# Altium schematic sheet KeyBoard_LED.SchDoc
size A1
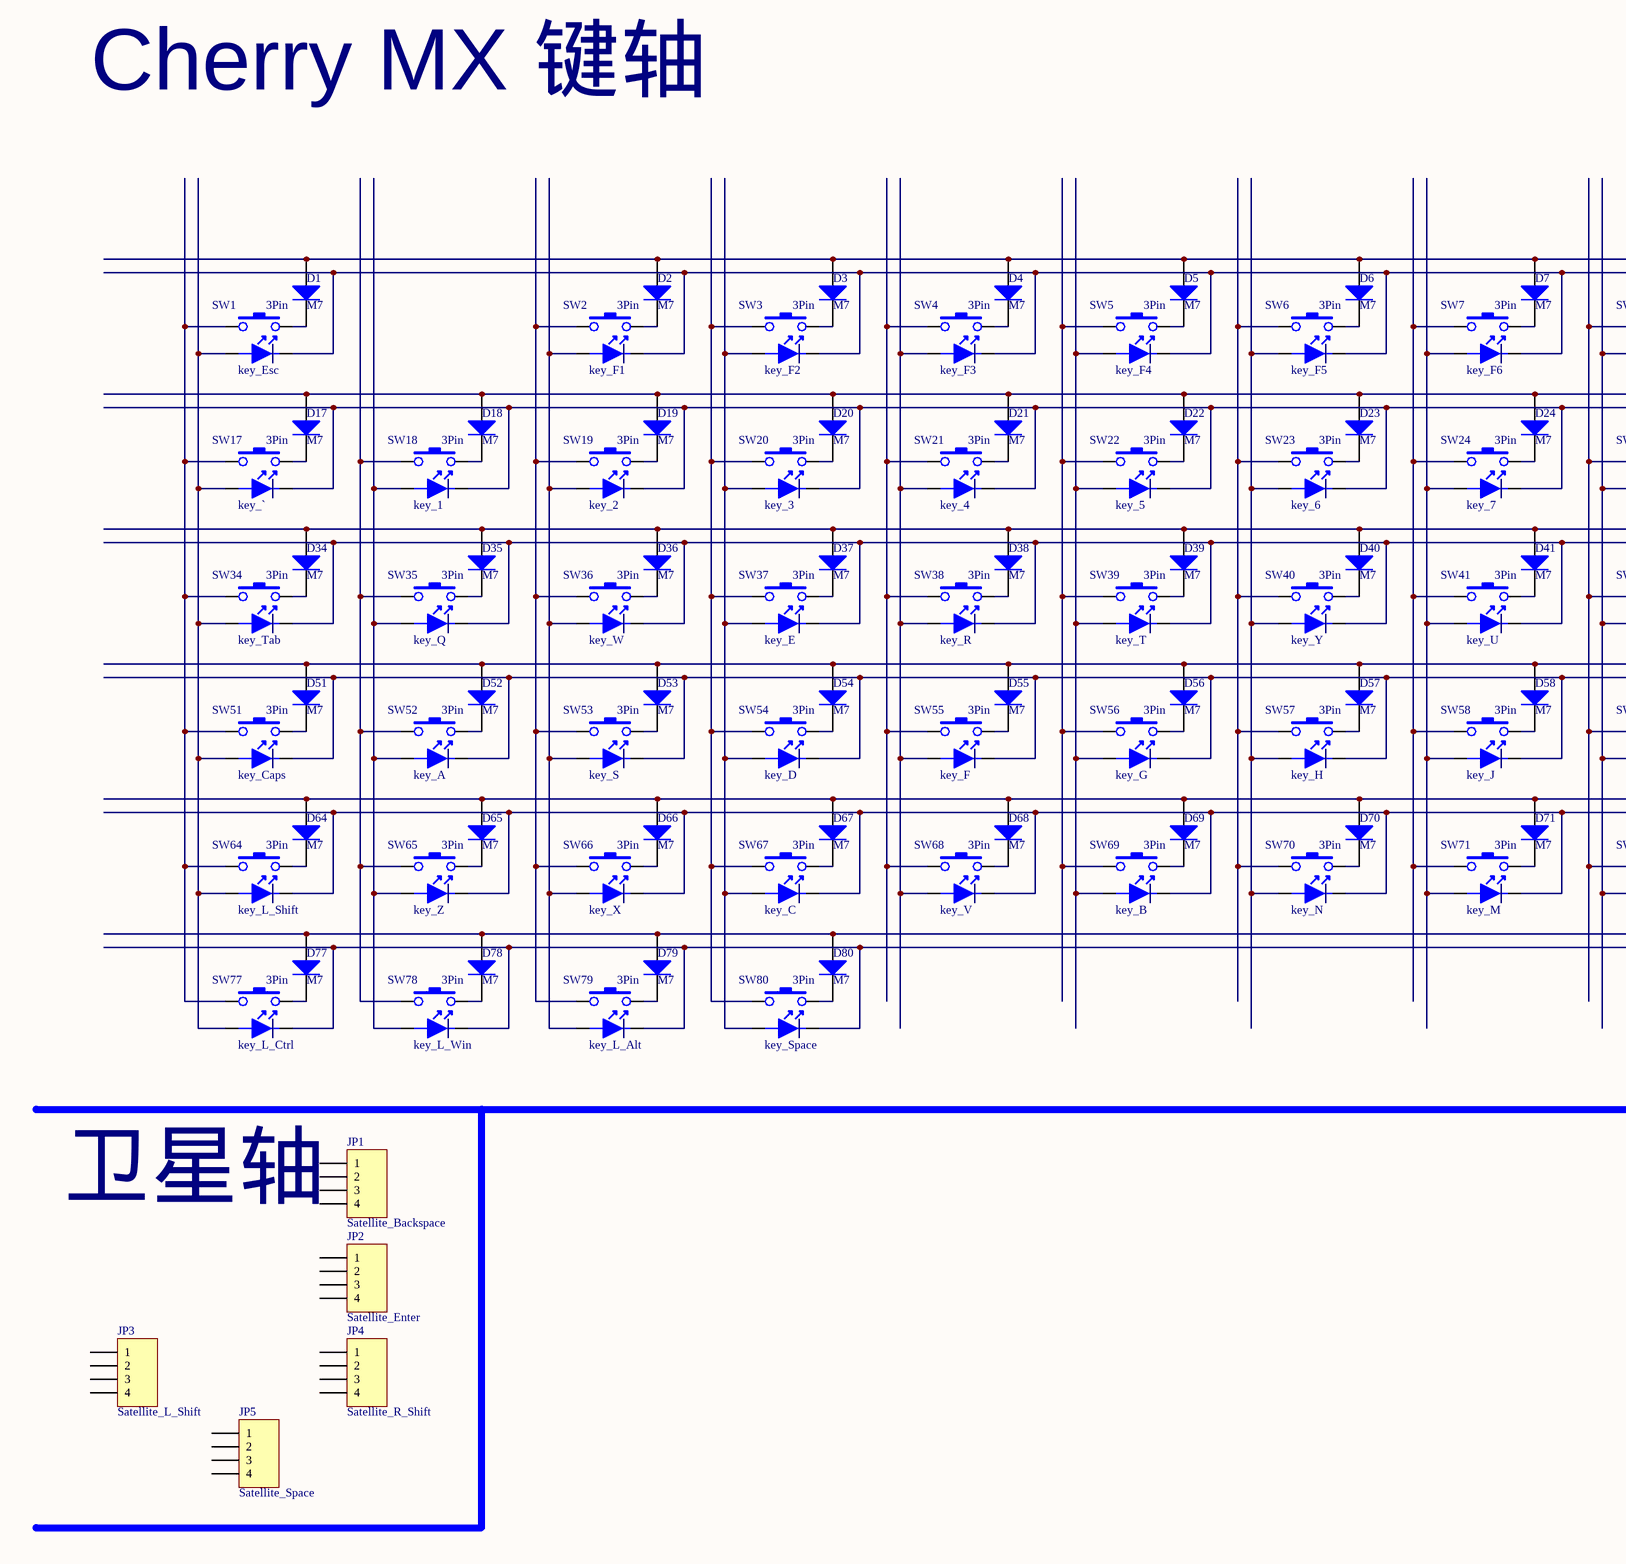
[diagram p0: KeyBoard_LED.SchDoc, left]
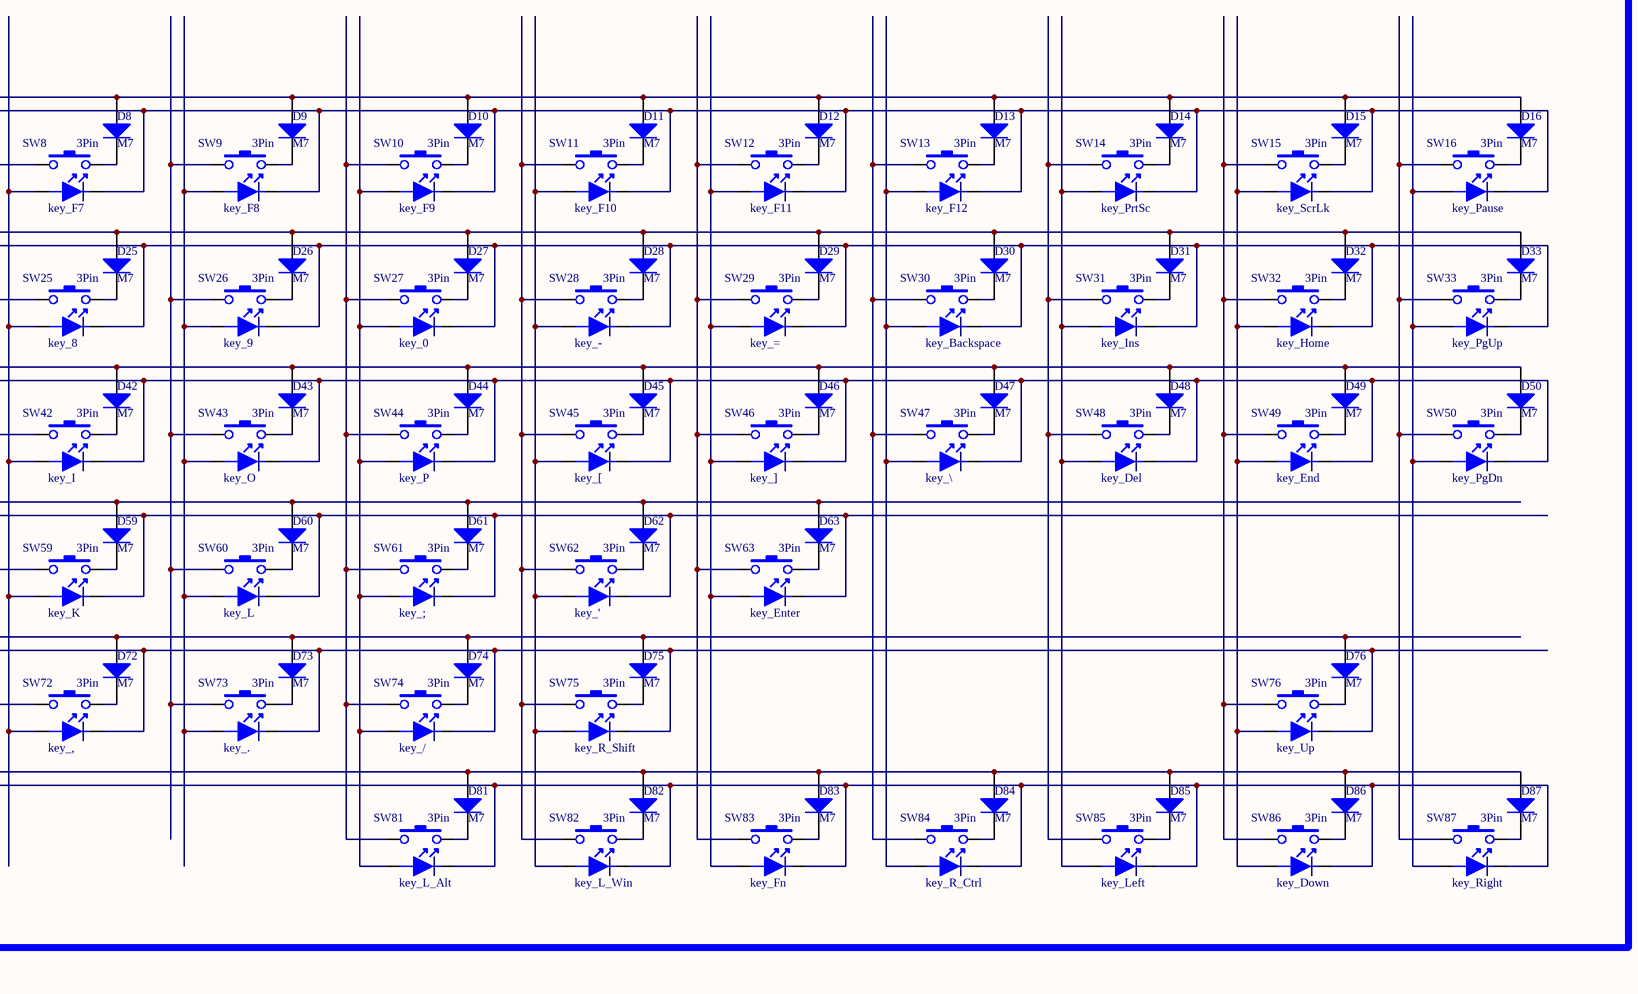
[diagram p1: KeyBoard_LED.SchDoc, right]

## Parts
D1  M7  [SMA(DO-214AC)_S1]
D2  M7  [SMA(DO-214AC)_S1]
D3  M7  [SMA(DO-214AC)_S1]
D4  M7  [SMA(DO-214AC)_S1]
D5  M7  [SMA(DO-214AC)_S1]
D6  M7  [SMA(DO-214AC)_S1]
D7  M7  [SMA(DO-214AC)_S1]
D8  M7  [SMA(DO-214AC)_S1]
D9  M7  [SMA(DO-214AC)_S1]
D10  M7  [SMA(DO-214AC)_S1]
D11  M7  [SMA(DO-214AC)_S1]
D12  M7  [SMA(DO-214AC)_S1]
D13  M7  [SMA(DO-214AC)_S1]
D14  M7  [SMA(DO-214AC)_S1]
D15  M7  [SMA(DO-214AC)_S1]
D16  M7  [SMA(DO-214AC)_S1]
D17  M7  [SMA(DO-214AC)_S1]
D18  M7  [SMA(DO-214AC)_S1]
D19  M7  [SMA(DO-214AC)_S1]
D20  M7  [SMA(DO-214AC)_S1]
D21  M7  [SMA(DO-214AC)_S1]
D22  M7  [SMA(DO-214AC)_S1]
D23  M7  [SMA(DO-214AC)_S1]
D24  M7  [SMA(DO-214AC)_S1]
D25  M7  [SMA(DO-214AC)_S1]
D26  M7  [SMA(DO-214AC)_S1]
D27  M7  [SMA(DO-214AC)_S1]
D28  M7  [SMA(DO-214AC)_S1]
D29  M7  [SMA(DO-214AC)_S1]
D30  M7  [SMA(DO-214AC)_S1]
D31  M7  [SMA(DO-214AC)_S1]
D32  M7  [SMA(DO-214AC)_S1]
D33  M7  [SMA(DO-214AC)_S1]
D34  M7  [SMA(DO-214AC)_S1]
D35  M7  [SMA(DO-214AC)_S1]
D36  M7  [SMA(DO-214AC)_S1]
D37  M7  [SMA(DO-214AC)_S1]
D38  M7  [SMA(DO-214AC)_S1]
D39  M7  [SMA(DO-214AC)_S1]
D40  M7  [SMA(DO-214AC)_S1]
D41  M7  [SMA(DO-214AC)_S1]
D42  M7  [SMA(DO-214AC)_S1]
D43  M7  [SMA(DO-214AC)_S1]
D44  M7  [SMA(DO-214AC)_S1]
D45  M7  [SMA(DO-214AC)_S1]
D46  M7  [SMA(DO-214AC)_S1]
D47  M7  [SMA(DO-214AC)_S1]
D48  M7  [SMA(DO-214AC)_S1]
D49  M7  [SMA(DO-214AC)_S1]
D50  M7  [SMA(DO-214AC)_S1]
D51  M7  [SMA(DO-214AC)_S1]
D52  M7  [SMA(DO-214AC)_S1]
D53  M7  [SMA(DO-214AC)_S1]
D54  M7  [SMA(DO-214AC)_S1]
D55  M7  [SMA(DO-214AC)_S1]
D56  M7  [SMA(DO-214AC)_S1]
D57  M7  [SMA(DO-214AC)_S1]
D58  M7  [SMA(DO-214AC)_S1]
D59  M7  [SMA(DO-214AC)_S1]
D60  M7  [SMA(DO-214AC)_S1]
D61  M7  [SMA(DO-214AC)_S1]
D62  M7  [SMA(DO-214AC)_S1]
D63  M7  [SMA(DO-214AC)_S1]
D64  M7  [SMA(DO-214AC)_S1]
D65  M7  [SMA(DO-214AC)_S1]
D66  M7  [SMA(DO-214AC)_S1]
D67  M7  [SMA(DO-214AC)_S1]
D68  M7  [SMA(DO-214AC)_S1]
D69  M7  [SMA(DO-214AC)_S1]
D70  M7  [SMA(DO-214AC)_S1]
D71  M7  [SMA(DO-214AC)_S1]
D72  M7  [SMA(DO-214AC)_S1]
D73  M7  [SMA(DO-214AC)_S1]
D74  M7  [SMA(DO-214AC)_S1]
D75  M7  [SMA(DO-214AC)_S1]
D76  M7  [SMA(DO-214AC)_S1]
D77  M7  [SMA(DO-214AC)_S1]
D78  M7  [SMA(DO-214AC)_S1]
D79  M7  [SMA(DO-214AC)_S1]
D80  M7  [SMA(DO-214AC)_S1]
D81  M7  [SMA(DO-214AC)_S1]
D82  M7  [SMA(DO-214AC)_S1]
D83  M7  [SMA(DO-214AC)_S1]
D84  M7  [SMA(DO-214AC)_S1]
D85  M7  [SMA(DO-214AC)_S1]
D86  M7  [SMA(DO-214AC)_S1]
D87  M7  [SMA(DO-214AC)_S1]
JP1  Satellite_Backspace  [1x2]
JP2  Satellite_Enter  [1x2]
JP3  Satellite_L_Shift  [1x2]
JP4  Satellite_R_Shift  [1x2]
JP5  Satellite_Space  [1x6.25]
SW1  key_Esc  [MX_SW_3_LED]
SW2  key_F1  [MX_SW_3_LED]
SW3  key_F2  [MX_SW_3_LED]
SW4  key_F3  [MX_SW_3_LED]
SW5  key_F4  [MX_SW_3_LED]
SW6  key_F5  [MX_SW_3_LED]
SW7  key_F6  [MX_SW_3_LED]
SW8  key_F7  [MX_SW_3_LED]
SW9  key_F8  [MX_SW_3_LED]
SW10  key_F9  [MX_SW_3_LED]
SW11  key_F10  [MX_SW_3_LED]
SW12  key_F11  [MX_SW_3_LED]
SW13  key_F12  [MX_SW_3_LED]
SW14  key_PrtSc  [MX_SW_3_LED]
SW15  key_ScrLk  [MX_SW_3_LED]
SW16  key_Pause  [MX_SW_3_LED]
SW17  key_`  [MX_SW_3_LED]
SW18  key_1  [MX_SW_3_LED]
SW19  key_2  [MX_SW_3_LED]
SW20  key_3  [MX_SW_3_LED]
SW21  key_4  [MX_SW_3_LED]
SW22  key_5  [MX_SW_3_LED]
SW23  key_6  [MX_SW_3_LED]
SW24  key_7  [MX_SW_3_LED]
SW25  key_8  [MX_SW_3_LED]
SW26  key_9  [MX_SW_3_LED]
SW27  key_0  [MX_SW_3_LED]
SW28  key_-  [MX_SW_3_LED]
SW29  key_=  [MX_SW_3_LED]
SW30  key_Backspace  [MX_SW_3_LED]
SW31  key_Ins  [MX_SW_3_LED]
SW32  key_Home  [MX_SW_3_LED]
SW33  key_PgUp  [MX_SW_3_LED]
SW34  key_Tab  [MX_SW_3_LED]
SW35  key_Q  [MX_SW_3_LED]
SW36  key_W  [MX_SW_3_LED]
SW37  key_E  [MX_SW_3_LED]
SW38  key_R  [MX_SW_3_LED]
SW39  key_T  [MX_SW_3_LED]
SW40  key_Y  [MX_SW_3_LED]
SW41  key_U  [MX_SW_3_LED]
SW42  key_I  [MX_SW_3_LED]
SW43  key_O  [MX_SW_3_LED]
SW44  key_P  [MX_SW_3_LED]
SW45  key_[  [MX_SW_3_LED]
SW46  key_]  [MX_SW_3_LED]
SW47  key_\  [MX_SW_3_LED]
SW48  key_Del  [MX_SW_3_LED]
SW49  key_End  [MX_SW_3_LED]
SW50  key_PgDn  [MX_SW_3_LED]
SW51  key_Caps  [MX_SW_3_LED]
SW52  key_A  [MX_SW_3_LED]
SW53  key_S  [MX_SW_3_LED]
SW54  key_D  [MX_SW_3_LED]
SW55  key_F  [MX_SW_3_LED]
SW56  key_G  [MX_SW_3_LED]
SW57  key_H  [MX_SW_3_LED]
SW58  key_J  [MX_SW_3_LED]
SW59  key_K  [MX_SW_3_LED]
SW60  key_L  [MX_SW_3_LED]
SW61  key_;  [MX_SW_3_LED]
SW62  key_'  [MX_SW_3_LED]
SW63  key_Enter  [MX_SW_3_LED]
SW64  key_L_Shift  [MX_SW_3_LED]
SW65  key_Z  [MX_SW_3_LED]
SW66  key_X  [MX_SW_3_LED]
SW67  key_C  [MX_SW_3_LED]
SW68  key_V  [MX_SW_3_LED]
SW69  key_B  [MX_SW_3_LED]
SW70  key_N  [MX_SW_3_LED]
SW71  key_M  [MX_SW_3_LED]
SW72  key_,  [MX_SW_3_LED]
SW73  key_.  [MX_SW_3_LED]
SW74  key_/  [MX_SW_3_LED]
SW75  key_R_Shift  [MX_SW_3_LED]
SW76  key_Up  [MX_SW_3_LED]
SW77  key_L_Ctrl  [MX_SW_3_LED]
SW78  key_L_Win  [MX_SW_3_LED]
SW79  key_L_Alt  [MX_SW_3_LED]
SW80  key_Space  [MX_SW_3_LED]
SW81  key_L_Alt  [MX_SW_3_LED]
SW82  key_L_Win  [MX_SW_3_LED]
SW83  key_Fn  [MX_SW_3_LED]
SW84  key_R_Ctrl  [MX_SW_3_LED]
SW85  key_Left  [MX_SW_3_LED]
SW86  key_Down  [MX_SW_3_LED]
SW87  key_Right  [MX_SW_3_LED]

## Nets
NetD1_1: D1.1(A) D2.1(A) D3.1(A) D4.1(A) D5.1(A) D6.1(A) D7.1(A) D8.1(A) D9.1(A) D10.1(A) D11.1(A) D12.1(A) D13.1(A) D14.1(A) D15.1(A) D16.1(A)
NetD1_2: D1.2(K) SW1.2
NetD2_2: D2.2(K) SW2.2
NetD3_2: D3.2(K) SW3.2
NetD4_2: D4.2(K) SW4.2
NetD5_2: D5.2(K) SW5.2
NetD6_2: D6.2(K) SW6.2
NetD7_2: D7.2(K) SW7.2
NetD8_2: D8.2(K) SW8.2
NetD9_2: D9.2(K) SW9.2
NetD10_2: D10.2(K) SW10.2
NetD11_2: D11.2(K) SW11.2
NetD12_2: D12.2(K) SW12.2
NetD13_2: D13.2(K) SW13.2
NetD14_2: D14.2(K) SW14.2
NetD15_2: D15.2(K) SW15.2
NetD16_2: D16.2(K) SW16.2
NetD17_1: D17.1(A) D18.1(A) D19.1(A) D20.1(A) D21.1(A) D22.1(A) D23.1(A) D24.1(A) D25.1(A) D26.1(A) D27.1(A) D28.1(A) D29.1(A) D30.1(A) D31.1(A) D32.1(A) D33.1(A)
NetD17_2: D17.2(K) SW17.2
NetD18_2: D18.2(K) SW18.2
NetD19_2: D19.2(K) SW19.2
NetD20_2: D20.2(K) SW20.2
NetD21_2: D21.2(K) SW21.2
NetD22_2: D22.2(K) SW22.2
NetD23_2: D23.2(K) SW23.2
NetD24_2: D24.2(K) SW24.2
NetD25_2: D25.2(K) SW25.2
NetD26_2: D26.2(K) SW26.2
NetD27_2: D27.2(K) SW27.2
NetD28_2: D28.2(K) SW28.2
NetD29_2: D29.2(K) SW29.2
NetD30_2: D30.2(K) SW30.2
NetD31_2: D31.2(K) SW31.2
NetD32_2: D32.2(K) SW32.2
NetD33_2: D33.2(K) SW33.2
NetD34_1: D34.1(A) D35.1(A) D36.1(A) D37.1(A) D38.1(A) D39.1(A) D40.1(A) D41.1(A) D42.1(A) D43.1(A) D44.1(A) D45.1(A) D46.1(A) D47.1(A) D48.1(A) D49.1(A) D50.1(A)
NetD34_2: D34.2(K) SW34.2
NetD35_2: D35.2(K) SW35.2
NetD36_2: D36.2(K) SW36.2
NetD37_2: D37.2(K) SW37.2
NetD38_2: D38.2(K) SW38.2
NetD39_2: D39.2(K) SW39.2
NetD40_2: D40.2(K) SW40.2
NetD41_2: D41.2(K) SW41.2
NetD42_2: D42.2(K) SW42.2
NetD43_2: D43.2(K) SW43.2
NetD44_2: D44.2(K) SW44.2
NetD45_2: D45.2(K) SW45.2
NetD46_2: D46.2(K) SW46.2
NetD47_2: D47.2(K) SW47.2
NetD48_2: D48.2(K) SW48.2
NetD49_2: D49.2(K) SW49.2
NetD50_2: D50.2(K) SW50.2
NetD51_1: D51.1(A) D52.1(A) D53.1(A) D54.1(A) D55.1(A) D56.1(A) D57.1(A) D58.1(A) D59.1(A) D60.1(A) D61.1(A) D62.1(A) D63.1(A)
NetD51_2: D51.2(K) SW51.2
NetD52_2: D52.2(K) SW52.2
NetD53_2: D53.2(K) SW53.2
NetD54_2: D54.2(K) SW54.2
NetD55_2: D55.2(K) SW55.2
NetD56_2: D56.2(K) SW56.2
NetD57_2: D57.2(K) SW57.2
NetD58_2: D58.2(K) SW58.2
NetD59_2: D59.2(K) SW59.2
NetD60_2: D60.2(K) SW60.2
NetD61_2: D61.2(K) SW61.2
NetD62_2: D62.2(K) SW62.2
NetD63_2: D63.2(K) SW63.2
NetD64_1: D64.1(A) D65.1(A) D66.1(A) D67.1(A) D68.1(A) D69.1(A) D70.1(A) D71.1(A) D72.1(A) D73.1(A) D74.1(A) D75.1(A) D76.1(A)
NetD64_2: D64.2(K) SW64.2
NetD65_2: D65.2(K) SW65.2
NetD66_2: D66.2(K) SW66.2
NetD67_2: D67.2(K) SW67.2
NetD68_2: D68.2(K) SW68.2
NetD69_2: D69.2(K) SW69.2
NetD70_2: D70.2(K) SW70.2
NetD71_2: D71.2(K) SW71.2
NetD72_2: D72.2(K) SW72.2
NetD73_2: D73.2(K) SW73.2
NetD74_2: D74.2(K) SW74.2
NetD75_2: D75.2(K) SW75.2
NetD76_2: D76.2(K) SW76.2
NetD77_1: D77.1(A) D78.1(A) D79.1(A) D80.1(A) D81.1(A) D82.1(A) D83.1(A) D84.1(A) D85.1(A) D86.1(A) D87.1(A)
NetD77_2: D77.2(K) SW77.2
NetD78_2: D78.2(K) SW78.2
NetD79_2: D79.2(K) SW79.2
NetD80_2: D80.2(K) SW80.2
NetD81_2: D81.2(K) SW81.2
NetD82_2: D82.2(K) SW82.2
NetD83_2: D83.2(K) SW83.2
NetD84_2: D84.2(K) SW84.2
NetD85_2: D85.2(K) SW85.2
NetD86_2: D86.2(K) SW86.2
NetD87_2: D87.2(K) SW87.2
NetSW1_1: SW1.1 SW17.1 SW34.1 SW51.1 SW64.1 SW77.1
NetSW1_3: SW1.3 SW17.3 SW34.3 SW51.3 SW64.3 SW77.3
NetSW1_4: SW1.4 SW2.4 SW3.4 SW4.4 SW5.4 SW6.4 SW7.4 SW8.4 SW9.4 SW10.4 SW11.4 SW12.4 SW13.4 SW14.4 SW15.4 SW16.4
NetSW2_1: SW2.1 SW19.1 SW36.1 SW53.1 SW66.1 SW79.1
NetSW2_3: SW2.3 SW19.3 SW36.3 SW53.3 SW66.3 SW79.3
NetSW3_1: SW3.1 SW20.1 SW37.1 SW54.1 SW67.1 SW80.1
NetSW3_3: SW3.3 SW20.3 SW37.3 SW54.3 SW67.3 SW80.3
NetSW4_1: SW4.1 SW21.1 SW38.1 SW55.1 SW68.1
NetSW4_3: SW4.3 SW21.3 SW38.3 SW55.3 SW68.3
NetSW5_1: SW5.1 SW22.1 SW39.1 SW56.1 SW69.1
NetSW5_3: SW5.3 SW22.3 SW39.3 SW56.3 SW69.3
NetSW6_1: SW6.1 SW23.1 SW40.1 SW57.1 SW70.1
NetSW6_3: SW6.3 SW23.3 SW40.3 SW57.3 SW70.3
NetSW7_1: SW7.1 SW24.1 SW41.1 SW58.1 SW71.1
NetSW7_3: SW7.3 SW24.3 SW41.3 SW58.3 SW71.3
NetSW8_1: SW8.1 SW25.1 SW42.1 SW59.1 SW72.1
NetSW8_3: SW8.3 SW25.3 SW42.3 SW59.3 SW72.3
NetSW9_1: SW9.1 SW26.1 SW43.1 SW60.1 SW73.1
NetSW9_3: SW9.3 SW26.3 SW43.3 SW60.3 SW73.3
NetSW10_1: SW10.1 SW27.1 SW44.1 SW61.1 SW74.1 SW81.1
NetSW10_3: SW10.3 SW27.3 SW44.3 SW61.3 SW74.3 SW81.3
NetSW11_1: SW11.1 SW28.1 SW45.1 SW62.1 SW75.1 SW82.1
NetSW11_3: SW11.3 SW28.3 SW45.3 SW62.3 SW75.3 SW82.3
NetSW12_1: SW12.1 SW29.1 SW46.1 SW63.1 SW83.1
NetSW12_3: SW12.3 SW29.3 SW46.3 SW63.3 SW83.3
NetSW13_1: SW13.1 SW30.1 SW47.1 SW84.1
NetSW13_3: SW13.3 SW30.3 SW47.3 SW84.3
NetSW14_1: SW14.1 SW31.1 SW48.1 SW85.1
NetSW14_3: SW14.3 SW31.3 SW48.3 SW85.3
NetSW15_1: SW15.1 SW32.1 SW49.1 SW76.1 SW86.1
NetSW15_3: SW15.3 SW32.3 SW49.3 SW76.3 SW86.3
NetSW16_1: SW16.1 SW33.1 SW50.1 SW87.1
NetSW16_3: SW16.3 SW33.3 SW50.3 SW87.3
NetSW17_4: SW17.4 SW18.4 SW19.4 SW20.4 SW21.4 SW22.4 SW23.4 SW24.4 SW25.4 SW26.4 SW27.4 SW28.4 SW29.4 SW30.4 SW31.4 SW32.4 SW33.4
NetSW18_1: SW18.1 SW35.1 SW52.1 SW65.1 SW78.1
NetSW18_3: SW18.3 SW35.3 SW52.3 SW65.3 SW78.3
NetSW34_4: SW34.4 SW35.4 SW36.4 SW37.4 SW38.4 SW39.4 SW40.4 SW41.4 SW42.4 SW43.4 SW44.4 SW45.4 SW46.4 SW47.4 SW48.4 SW49.4 SW50.4
NetSW51_4: SW51.4 SW52.4 SW53.4 SW54.4 SW55.4 SW56.4 SW57.4 SW58.4 SW59.4 SW60.4 SW61.4 SW62.4 SW63.4
NetSW64_4: SW64.4 SW65.4 SW66.4 SW67.4 SW68.4 SW69.4 SW70.4 SW71.4 SW72.4 SW73.4 SW74.4 SW75.4 SW76.4
NetSW77_4: SW77.4 SW78.4 SW79.4 SW80.4 SW81.4 SW82.4 SW83.4 SW84.4 SW85.4 SW86.4 SW87.4

Not connected (* = marked no-connect by the designer): JP1 1 2 3 4; JP2 1 2 3 4; JP3 1 2 3 4; JP4 1 2 3 4; JP5 1 2 3 4

## Notes on the sheet
- Cherry MX 键轴
- 卫星轴
- (in symbol MX_SW_3_LED) 3Pin

## Library data of the parts
D1-D87 = SMA(DO-214AC) M7: 二极管; Notepad: 1N4007 4007 编号C2464 已经停售, 使用新物料编号C95872; ComponentLink1Description: 供应商链接; ComponentLink1URL: http://www.szlcsc.com/product/details_2841.html; Package: SMA(DO-214AC); Supplier: LC; SuppliersPartNumber: C95872
JP1-JP5 = Header 4: Header, 4-Pin; LatestRevisionDate: 17-Jul-2002; LatestRevisionNote: Re-released for DXP Platform.; Publisher: Altium Limited
SW1-SW87 = MX_SW_3_LED: without Fixation pins  1-Pole w/LED